# Altium project 八入八出继电器工控板.PRJPCB
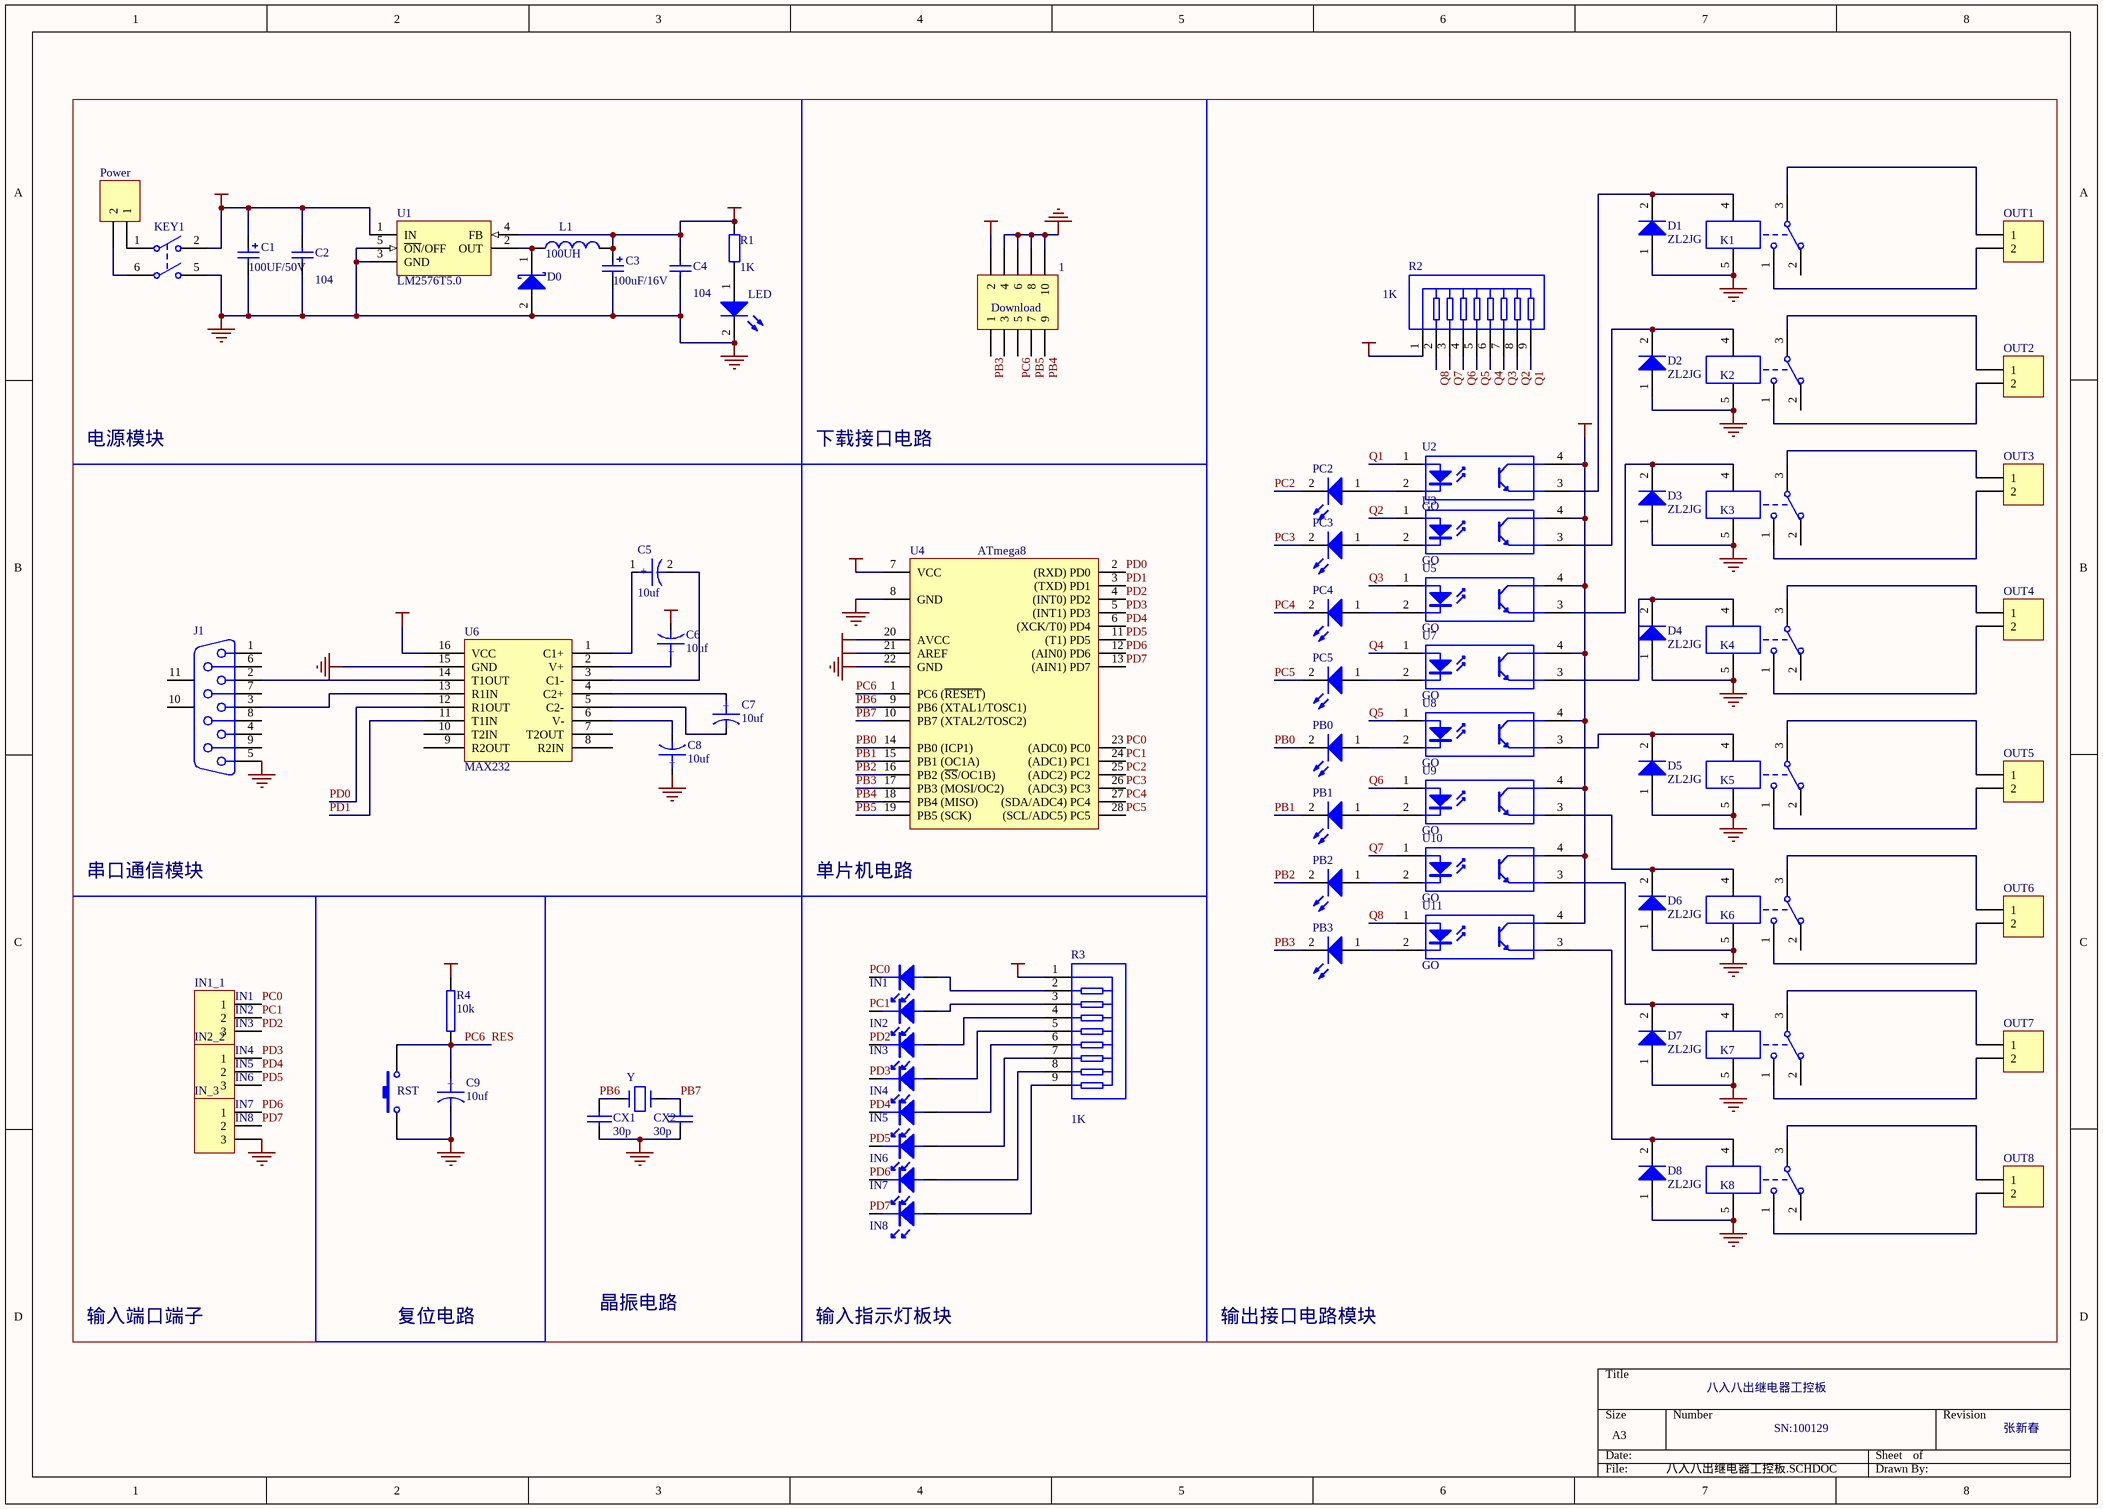
[diagram p0: 八入八出继电器工控板.SCHDOC]
1 sheet, 78 parts. Net scope: global (net labels, ports and power ports of the same name join across sheets).
Board file: 八入八出继电器工控板.PCBDOC

## Sheet 八入八出继电器工控板.SCHDOC
size A3

### Parts
1  Download  [HDR-2x5]
C1  value 100UF/50V  [C-DJ-6]  (hidden comment: DJDR)
C2  value 104  [CPDR]  (hidden comment: CPDR)
C3  value 100uF/16V  [C-DJ-6]  (hidden comment: DJDR)
C4  value 104  [CPDR]  (hidden comment: CPDR)
C5  10uf  [C-DJ-4]
C6  10uf  [C-DJ-4]
C7  10uf  [C-DJ-4]
C8  10uf  [C-DJ-4]
C9  10uf  [C-DJ-4]
CX1  30p  [HDR1X2]
CX2  30p  [HDR1X2]
D0  WY2JG  [ZCDZL]  (value not drawn)
D1  ZL2JG  [D-ZL-10]
D2  ZL2JG  [D-ZL-10]
D3  ZL2JG  [D-ZL-10]
D4  ZL2JG  [D-ZL-10]
D5  ZL2JG  [D-ZL-10]
D6  ZL2JG  [D-ZL-10]
D7  ZL2JG  [D-ZL-10]
D8  ZL2JG  [D-ZL-10]
IN1  LED  [HDR1X2]  (value not drawn)
IN1_1  PZ_3  [JK128_3]  (value not drawn)
IN2  LED  [HDR1X2]  (value not drawn)
IN2_2  PZ_3  [JK128_3]
IN3  LED  [HDR1X2]  (value not drawn)
IN4  LED  [HDR1X2]  (value not drawn)
IN5  LED  [HDR1X2]  (value not drawn)
IN6  LED  [HDR1X2]  (value not drawn)
IN7  LED  [HDR1X2]  (value not drawn)
IN8  LED  [HDR1X2]  (value not drawn)
IN_3  (no value)  [JK128_3]
J1  D Connector 9  [DSUB1.385-2H9]  (value not drawn)
K1  JDQYCK  [JQC-3F/T73]  (value not drawn)
K2  JDQYCK  [JQC-3F/T73]  (value not drawn)
K3  JDQYCK  [JQC-3F/T73]  (value not drawn)
K4  JDQYCK  [JQC-3F/T73]  (value not drawn)
K5  JDQYCK  [JQC-3F/T73]  (value not drawn)
K6  JDQYCK  [JQC-3F/T73]  (value not drawn)
K7  JDQYCK  [JQC-3F/T73]  (value not drawn)
K8  JDQYCK  [JQC-3F/T73]  (value not drawn)
KEY1  SW-DPST  [DPDT-6]  (value not drawn)
L1  value 100UH  [L_DG]  (hidden comment: DG)
LED  LED  [LED_D]  (value not drawn)
OUT1  PZ_2  [DYDZ]  (value not drawn)
OUT2  PZ_2  [DYDZ]  (value not drawn)
OUT3  PZ_2  [DYDZ]  (value not drawn)
OUT4  PZ_2  [DYDZ]  (value not drawn)
OUT5  PZ_2  [DYDZ]  (value not drawn)
OUT6  PZ_2  [DYDZ]  (value not drawn)
OUT7  PZ_2  [DYDZ]  (value not drawn)
OUT8  PZ_2  [DYDZ]  (value not drawn)
PB0  (no value)  [CPDR]
PB1  (no value)  [CPDR]
PB2  (no value)  [CPDR]
PB3  (no value)  [CPDR]
PC2  (no value)  [CPDR]
PC3  (no value)  [CPDR]
PC4  (no value)  [CPDR]
PC5  (no value)  [CPDR]
Power  PZ_2  [JK128_2]  (value not drawn)
R1  value 1K  [RSE]  (hidden comment: Res)
R2  value 1K  [HDR-9]
R3  value 1K  [HDR-9]
R4  10k  [RSE]
RST  (no value)  [an-6*6]
U1  LM2576T5.0  [T05A]
U2  GO  [DIP-4]
U3  GO  [DIP-4]
U4  ATmega8  [DIP-28]
U5  GO  [DIP-4]
U6  MAX232  [DIP16]
U7  GO  [DIP-4]
U8  GO  [DIP-4]
U9  GO  [DIP-4]
U10  GO  [DIP-4]
U11  GO  [DIP-4]
Y1  Y  [JZ_ZC]

### Nets
+12V: C1.1 C2.2 KEY1.2(NO1) U1.1(IN) U2.4(C) U3.4(C) U5.4(C) U7.4(C) U8.4(C) U9.4(C) U10.4(C) U11.4(C)
GND: 1.4 1.6 1.8 1.10 C1.2 C2.1 C3.2 C4.1 C8.1 C9.2 CX1.2 CX2.2 D0.2(K) D1.1(A) D2.1(A) D3.1(A) D4.1(A) D5.1(A) D6.1(A) D7.1(A) D8.1(A) IN_3.3 J1.5 K1.5 K2.5 K3.5 K4.5 K5.5 K6.5 K7.5 K8.5 KEY1.5(NO2) LED.2(K) RST.2 U1.3(GND) U1.5(~{ON}/OFF) U4.8(GND) U4.22(GND) U6.15(GND)
VCC: 1.2 C3.1 C4.2 C6.2 L1.2 R1.2 R2.1 R3.1 R4.2 U1.4(FB) U4.7(VCC) U4.20(AVCC) U4.21(AREF) U6.16(VCC)
PB0: PB0.2(K) U4.14(PB0_(ICP1))
PB1: PB1.2(K) U4.15(PB1_(OC1A))
PB2: PB2.2(K) U4.16(PB2_(~{SS}/OC1B))
PB3: 1.1 PB3.2(K) U4.17(PB3_(MOSI/OC2))
PB4: 1.9 U4.18(PB4_(MISO))
PB5: 1.7 U4.19(PB5_(SCK))
PB6: CX1.1 U4.9(PB6_(XTAL1/TOSC1)) Y1.2
PB7: CX2.1 U4.10(PB7_(XTAL2/TOSC2)) Y1.1
PC0: IN1.2(K) IN1_1.1 U4.23((ADC0)_PC0)
PC1: IN1_1.2 IN2.2(K) U4.24((ADC1)_PC1)
PC2: PC2.2(K) U4.25((ADC2)_PC2)
PC3: PC3.2(K) U4.26((ADC3)_PC3)
PC4: PC4.2(K) U4.27((SDA/ADC4)_PC4)
PC5: PC5.2(K) U4.28((SCL/ADC5)_PC5)
PC6: 1.5 C9.1 R4.1 RST.1 U4.1(PC6_(~{RESET}))  [also labelled RES]
PD0: U4.2((RXD)_PD0) U6.12(R1OUT)
PD1: U4.3((TXD)_PD1) U6.11(T1IN)
PD2: IN1_1.3 IN3.2(K) U4.4((INT0)_PD2)
PD3: IN2_2.1 IN4.2(K) U4.5((INT1)_PD3)
PD4: IN2_2.2 IN5.2(K) U4.6((XCK/T0)_PD4)
PD5: IN2_2.3 IN6.2(K) U4.11((T1)_PD5)
PD6: IN7.2(K) IN_3.1 U4.12((AIN0)_PD6)
PD7: IN8.2(K) IN_3.2 U4.13((AIN1)_PD7)
Q1: R2.9 U2.1(A)
Q2: R2.8 U3.1(A)
Q3: R2.7 U5.1(A)
Q4: R2.6 U7.1(A)
Q5: R2.5 U8.1(A)
Q6: R2.4 U9.1(A)
Q7: R2.3 U10.1(A)
Q8: R2.2 U11.1(A)
NetC5_1: C5.1 U6.1(C1+)
NetC5_2: C5.2 U6.3(C1-)
NetC6_1: C6.1 U6.2(V+)
NetC7_1: C7.1 U6.4(C2+)
NetC7_2: C7.2 U6.5(C2-)
NetC8_2: C8.2 U6.6(V-)
NetD0_1: D0.1(A) L1.1 U1.2(OUT)
NetD1_2: D1.2(K) K1.4 U2.3(E)
NetD2_2: D2.2(K) K2.4 U3.3(E)
NetD3_2: D3.2(K) K3.4 U5.3(E)
NetD4_2: D4.2(K) K4.4 U7.3(E)
NetD5_2: D5.2(K) K5.4 U8.3(E)
NetD6_2: D6.2(K) K6.4 U9.3(E)
NetD7_2: D7.2(K) K7.4 U10.3(E)
NetD8_2: D8.2(K) K8.4 U11.3(E)
NetIN1_1: IN1.1(A) R3.2
NetIN2_1: IN2.1(A) R3.3
NetIN3_1: IN3.1(A) R3.4
NetIN4_1: IN4.1(A) R3.5
NetIN5_1: IN5.1(A) R3.6
NetIN6_1: IN6.1(A) R3.7
NetIN7_1: IN7.1(A) R3.8
NetIN8_1: IN8.1(A) R3.9
NetJ1_2: J1.2 U6.14(T1OUT)
NetJ1_3: J1.3 U6.13(R1IN)
NetK1_1: K1.1 OUT1.2
NetK1_3: K1.3 OUT1.1
NetK2_1: K2.1 OUT2.2
NetK2_3: K2.3 OUT2.1
NetK3_1: K3.1 OUT3.2
NetK3_3: K3.3 OUT3.1
NetK4_1: K4.1 OUT4.2
NetK4_3: K4.3 OUT4.1
NetK5_1: K5.1 OUT5.2
NetK5_3: K5.3 OUT5.1
NetK6_1: K6.1 OUT6.2
NetK6_3: K6.3 OUT6.1
NetK7_1: K7.1 OUT7.2
NetK7_3: K7.3 OUT7.1
NetK8_1: K8.1 OUT8.2
NetK8_3: K8.3 OUT8.1
NetKEY1_1: KEY1.1(COMMON1) Power.1
NetKEY1_6: KEY1.6(COMMON2) Power.2
NetLED_1: LED.1(A) R1.1
NetPB0_1: PB0.1(A) U8.2(K)
NetPB1_1: PB1.1(A) U9.2(K)
NetPB2_1: PB2.1(A) U10.2(K)
NetPB3_1: PB3.1(A) U11.2(K)
NetPC2_1: PC2.1(A) U2.2(K)
NetPC3_1: PC3.1(A) U3.2(K)
NetPC4_1: PC4.1(A) U5.2(K)
NetPC5_1: PC5.1(A) U7.2(K)

Not connected (* = marked no-connect by the designer): 1 3; J1 1 4 6 7 8 9 10(MH1) 11(MH2); K1 2; K2 2; K3 2; K4 2; K5 2; K6 2; K7 2; K8 2; U6 7(T2OUT) 8(R2IN) 9(R2OUT) 10(T2IN)

### Notes on the sheet
- 电源模块
- 下载接口电路
- 串口通信模块
- 单片机电路
- (near IN1_1) IN1
- (near IN1_1) IN2
- (near IN1_1) IN3
- (near IN2_2) IN4
- (near IN2_2) IN5
- (near IN2_2) IN6
- (near IN_3) IN7
- (near IN_3) IN8
- 输入端口端子
- 复位电路
- 晶振电路
- 输入指示灯板块
- 输出接口电路模块
- 八入八出继电器工控板
- SN:100129
- 张新春
- (in symbol CAPACITOR POL) +

### Library data of the parts
1 = Header 5X2: Header, 5-Pin, Dual row; Revision: 17-Jul-2002: Re-released for DXP Platform.; Publisher: Altium Limited
C1 C3 = DJDR: 电解电容; Published: 8-Jun-2000; LatestRevisionDate: 17-Jul-2002; LatestRevisionNote: Re-released for DXP Platform.; Publisher: Altium Limited
C2 C4 = CPDR: 瓷片电容; Published: 8-Jun-2000; LatestRevisionDate: 17-Jul-2002; LatestRevisionNote: Re-released for DXP Platform.; Publisher: Altium Limited
C5-C9 = CAPACITOR POL: Capacitor
CX1 CX2 = CAP: Capacitor
D0 = WY2JG: 稳压二级管; Published: 8-Jun-2000; LatestRevisionDate: 17-Jul-2002; LatestRevisionNote: Re-released for DXP Platform.; Publisher: Altium Limited; Code_JEDEC: DO-214-AA
D1-D8 = ZL2JG: 整流二极管; Published: 8-Jun-2000; LatestRevisionDate: 17-Jul-2002; LatestRevisionNote: Re-released for DXP Platform.; DatasheetDocument: 1998; PackageDocument: Aug-1999; PackageReference: DO-201AD; Publisher: Altium Limited
IN1_1 IN2_2 IN_3 = PZ_3: 排针——3; LatestRevisionDate: 17-Jul-2002; LatestRevisionNote: Re-released for DXP Platform.; Publisher: Altium Limited
J1 = D Connector 9: Receptacle Assembly, 9 Position, Right Angle; Package Information: Latest Revision: O; Positions: 9; Published: 15-Jun-2001; Revision: 17-Jul-2002: Re-released for DXP Platform.; Datasheet: (1-Sep-1999); Package Reference: 788750; Publisher: Altium Limited; Orientation: Right Angle; Gender: Receptacle
K1-K8 = JDQYCK: 继电器——1常开1常闭; Published: 24-Mar-1999; LatestRevisionDate: 17-Jul-2002; LatestRevisionNote: Re-released for DXP Platform.; Publisher: Altium Limited
KEY1 = SW-DPST: Double-Pole, Single-Throw Switch; Published: 24-Mar-1999; Revision: July-2002: Re-released for DXP Platform.; Publisher: Altium Limited
L1 = DG: 电感; Code_IEC: 1005; Published: 8-Jun-2000; LatestRevisionDate: 17-Jul-2002; LatestRevisionNote: Re-released for DXP Platform.; PackageReference: 0402-A; Publisher: Altium Limited; Code_JEITA: 0402
LED PB0-PB3 PC2-PC5 = LED: 发光二极管; Published: 8-Jun-2000; LatestRevisionDate: 17-Jul-2002; LatestRevisionNote: Re-released for DXP Platform.; Publisher: Altium Limited
OUT1-OUT8 Power = PZ_2: 排针——2; LatestRevisionDate: 17-Jul-2002; LatestRevisionNote: Re-released for DXP Platform.; Publisher: Altium Limited
R1 = Res: 电阻; Published: 8-Jun-2000; LatestRevisionDate: 17-Jul-2002; LatestRevisionNote: Re-released for DXP Platform.; Publisher: Altium Limited
R2 R3 = Res PZ_8: 8位排阻; Published: 24-Mar-1999; LatestRevisionDate: 17-Jul-2002; LatestRevisionNote: Re-released for DXP Platform.; Publisher: Altium Limited; Code_JEDEC: MO-150-AC
R4 = RES2
RST = SW-PB: Switch; Published: 24-Mar-1999; LatestRevisionDate: 17-Jul-2002; LatestRevisionNote: Re-released for DXP Platform.; Publisher: Altium Limited
U1 = LM2576HVT-3.3: Simple Switcher 3A Step Down Voltage Regulator; PackageDocument: 2000; Note: Tab is connected to GND; Published: 15-Apr-2002; DatasheetDocument: Jun-1999; PackageReference: T05A; Publisher: Altium Limited; Code_JEDEC: TS-001-AA; ComponentLink1Description: Manufacturer Link; ComponentLink1URL: http://www.national.com/
U2 U3 U5 U7-U11 = GO: 光耦; Published: 24-Mar-1999; LatestRevisionDate: 17-Jul-2002; LatestRevisionNote: Re-released for DXP Platform.; Publisher: Altium Limited
U4 = ATmega8-P: 8 位微处理器/28引脚; 子类别: 微处理器; 发布者: 磊元工作室; 发布日期: 2003年8月18日; 制造商: Atmel Corporation; 类别: 集成电路; 元件名称（国标）: 8 位微处理器; 元件名称（英文）: 8-bit Microcontroller; 特性:存储器容量: Flash：8KB ，EEPROM：512B ，RAM：1KB; 特性:定时器/计数器: 2 个 8-bit ，1 个 16-bit; 特性:模/数转换器: 6 通道 10-bit ADC; 特性:指令: 两个时钟周期的硬件乘法器
Y1 = CRYSTAL